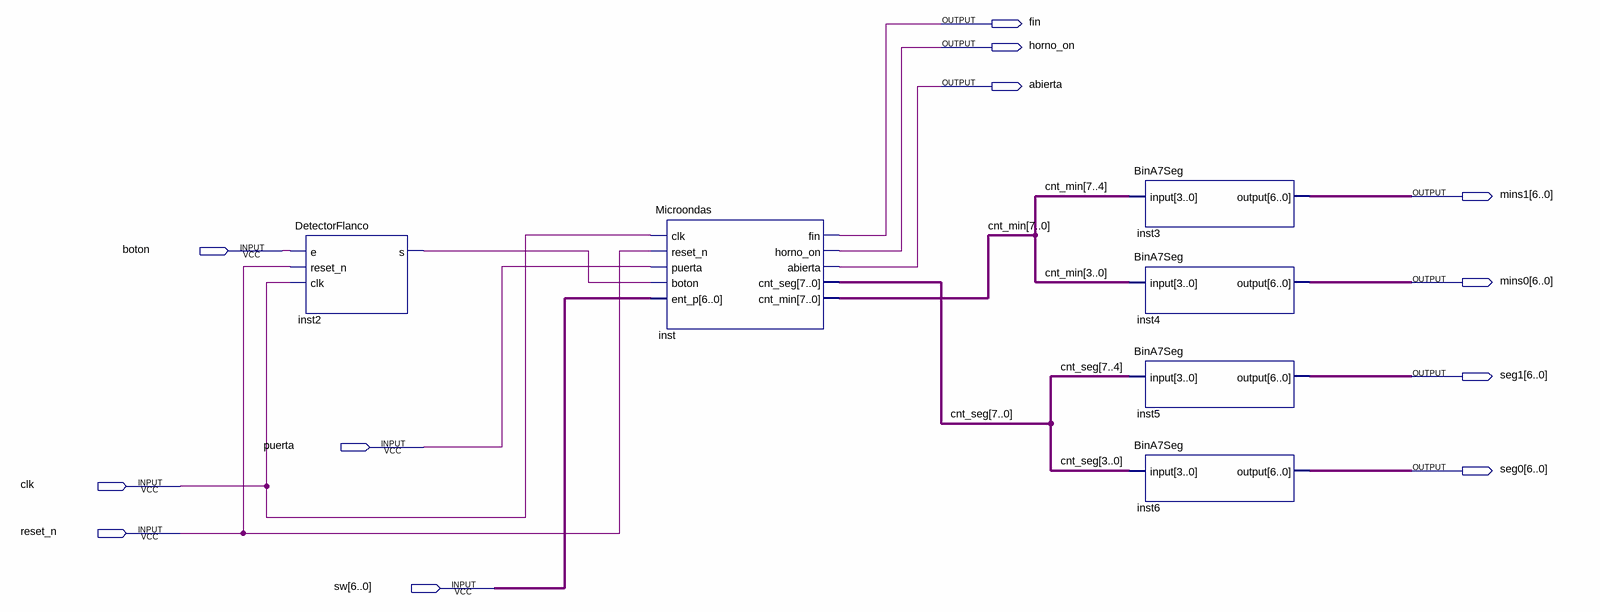
[diagram p0: schematic sheet]
// Quartus schematic Practica11.bdf as structural Verilog: 6 symbols, 12 pins
module Practica11 (
  input  boton,
  input  puerta,
  input  clk,
  input  reset_n,
  input  [6:0] sw,
  output fin,
  output horno_on,
  output abierta,
  output [6:0] mins1,
  output [6:0] mins0,
  output [6:0] seg1,
  output [6:0] seg0
);

  wire inst2_s;
  wire [7:0] cnt_min, cnt_seg;

  DetectorFlanco inst2 (.e(boton), .reset_n(reset_n), .clk(clk), .s(inst2_s));
  Microondas inst (
    .clk(clk), .reset_n(reset_n), .puerta(puerta), .boton(inst2_s), .ent_p(sw), .fin(fin),
    .horno_on(horno_on), .abierta(abierta), .cnt_seg(cnt_seg), .cnt_min(cnt_min));
  BinA7Seg inst3 (.\input (cnt_min[7:4]), .\output (mins1));
  BinA7Seg inst4 (.\input (cnt_min[3:0]), .\output (mins0));
  BinA7Seg inst5 (.\input (cnt_seg[7:4]), .\output (seg1));
  BinA7Seg inst6 (.\input (cnt_seg[3:0]), .\output (seg0));
endmodule
